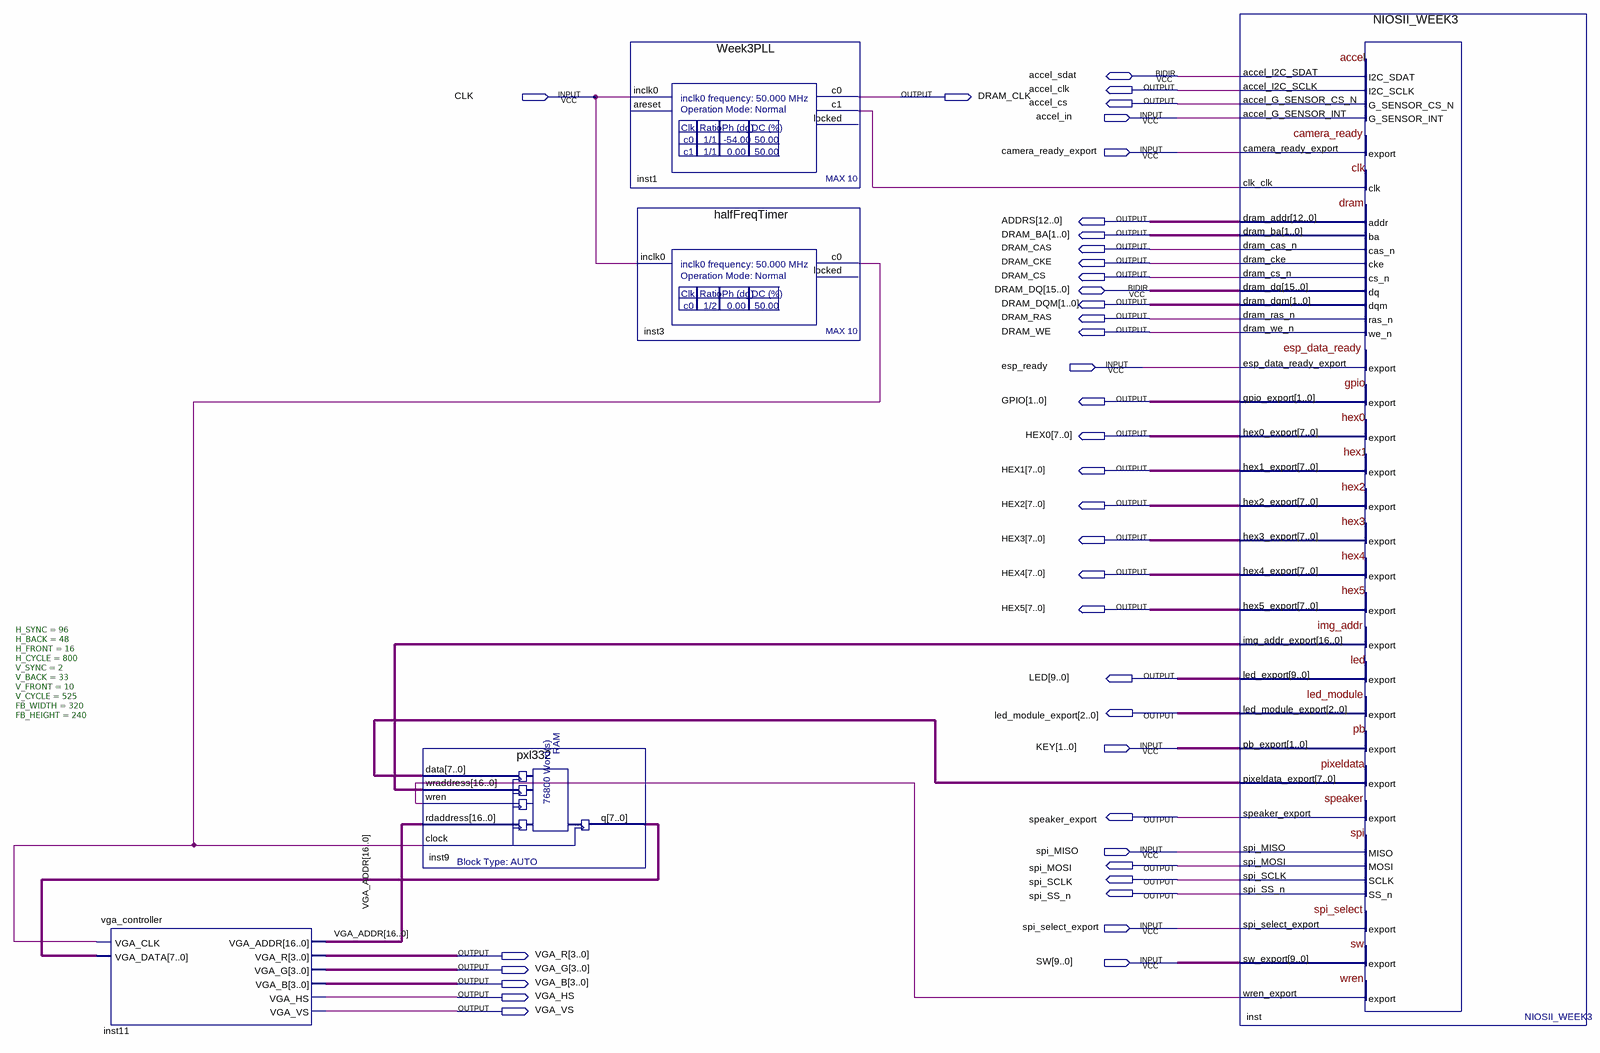
[diagram p0: schematic sheet]
// Quartus schematic schematic.bdf as structural Verilog: 5 symbols, 39 pins
module schematic (
  input  CLK,
  input  accel_in,
  input  camera_ready_export,
  input  esp_ready,
  input  [1:0] KEY,
  input  spi_MISO,
  input  spi_select_export,
  input  [9:0] SW,
  inout  accel_sdat,
  inout  [15:0] DRAM_DQ,
  output accel_clk,
  output DRAM_CLK,
  output accel_cs,
  output [12:0] ADDRS,
  output [1:0] DRAM_BA,
  output DRAM_CAS,
  output DRAM_CKE,
  output DRAM_CS,
  output [1:0] DRAM_DQM,
  output DRAM_RAS,
  output DRAM_WE,
  output [1:0] GPIO,
  output [7:0] HEX0,
  output [7:0] HEX1,
  output [7:0] HEX2,
  output [7:0] HEX3,
  output [7:0] HEX4,
  output [7:0] HEX5,
  output [9:0] LED,
  output [2:0] led_module_export,
  output speaker_export,
  output spi_MOSI,
  output spi_SCLK,
  output spi_SS_n,
  output [3:0] VGA_R,
  output [3:0] VGA_G,
  output [3:0] VGA_B,
  output VGA_HS,
  output VGA_VS
);

  wire inst1_c1, inst3_c0, inst_wren_export;
  wire [7:0] inst9_q, inst_pixeldata_export;
  wire [16:0] inst_img_addr_export, VGA_ADDR;

  vga_controller #(.H_SYNC(96), .H_BACK(48), .H_FRONT(16), .H_CYCLE(800), .V_SYNC(2), .V_BACK(33), .V_FRONT(10), .V_CYCLE(525), .FB_WIDTH(320), .FB_HEIGHT(240)) inst11 (
    .VGA_CLK(inst3_c0), .VGA_DATA(inst9_q), .VGA_ADDR(VGA_ADDR), .VGA_R(VGA_R), .VGA_G(VGA_G), .VGA_B(VGA_B),
    .VGA_HS(VGA_HS), .VGA_VS(VGA_VS));
  pxl332 inst9 (
    .data(inst_pixeldata_export), .wraddress(inst_img_addr_export), .wren(inst_wren_export),
    .rdaddress(VGA_ADDR), .clock(inst3_c0), .q(inst9_q));
  Week3PLL inst1 (.inclk0(CLK), .c0(DRAM_CLK), .c1(inst1_c1));  // open: areset, locked
  halfFreqTimer inst3 (.inclk0(CLK), .c0(inst3_c0));  // open: locked
  NIOSII_WEEK3 inst (
    .accel_G_SENSOR_INT(accel_in), .camera_ready_export(camera_ready_export), .clk_clk(inst1_c1),
    .esp_data_ready_export(esp_ready), .pb_export(KEY), .spi_MISO(spi_MISO),
    .spi_select_export(spi_select_export), .sw_export(SW), .accel_I2C_SCLK(accel_clk),
    .accel_G_SENSOR_CS_N(accel_cs), .dram_addr(ADDRS), .dram_ba(DRAM_BA), .dram_cas_n(DRAM_CAS),
    .dram_cke(DRAM_CKE), .dram_cs_n(DRAM_CS), .dram_dqm(DRAM_DQM), .dram_ras_n(DRAM_RAS),
    .dram_we_n(DRAM_WE), .gpio_export(GPIO), .hex0_export(HEX0), .hex1_export(HEX1), .hex2_export(HEX2),
    .hex3_export(HEX3), .hex4_export(HEX4), .hex5_export(HEX5), .img_addr_export(inst_img_addr_export),
    .led_export(LED), .led_module_export(led_module_export), .pixeldata_export(inst_pixeldata_export),
    .speaker_export(speaker_export), .spi_MOSI(spi_MOSI), .spi_SCLK(spi_SCLK), .spi_SS_n(spi_SS_n),
    .wren_export(inst_wren_export), .accel_I2C_SDAT(accel_sdat), .dram_dq(DRAM_DQ));
endmodule
